# Altium project ESP32_XPID.PrjPCB
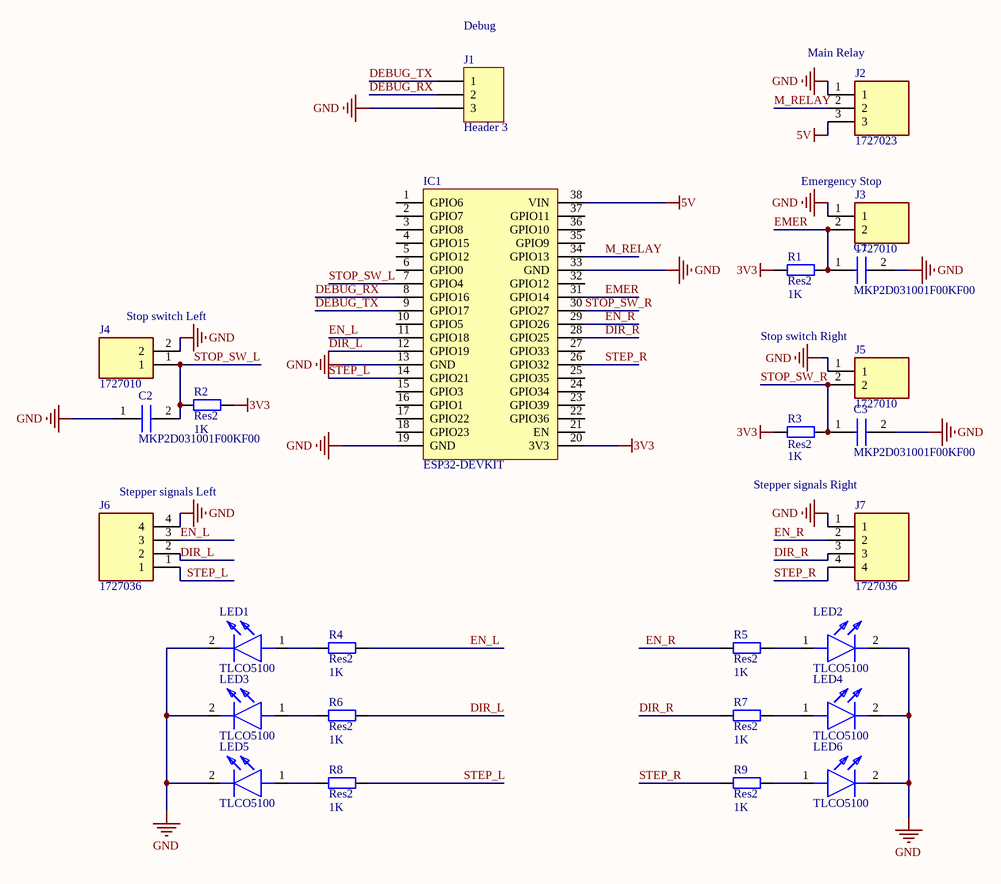
[diagram p0: ESP32_XPID.SchDoc]
1 sheet, 26 parts. Net scope: global (net labels, ports and power ports of the same name join across sheets).
Board file: ESP32_XPID.PcbDoc

## Sheet ESP32_XPID.SchDoc
size A1

### Parts
C1  MKP2D031001F00KF00  [MKP2D031001F00KF00]
C2  MKP2D031001F00KF00  [MKP2D031001F00KF00]
C3  MKP2D031001F00KF00  [MKP2D031001F00KF00]
IC1  ESP32-DEVKIT  [NODEMCU-32S]
J1  Header 3  [HDR1X3]
J2  1727023  [1727023]
J3  1727010  [1727010]
J4  1727010  [1727010]
J5  1727010  [1727010]
J6  1727036  [SHDR4W105P0X381_1X4_1523X730X865P]
J7  1727036  [SHDR4W105P0X381_1X4_1523X730X865P]
LED1  TLCO5100  [TLCO5100]
LED2  TLCO5100  [TLCO5100]
LED3  TLCO5100  [TLCO5100]
LED4  TLCO5100  [TLCO5100]
LED5  TLCO5100  [TLCO5100]
LED6  TLCO5100  [TLCO5100]
R1  Res2  value 1K  [AXIAL-0.4]
R2  Res2  value 1K  [AXIAL-0.4]
R3  Res2  value 1K  [AXIAL-0.4]
R4  Res2  value 1K  [AXIAL-0.4]
R5  Res2  value 1K  [AXIAL-0.4]
R6  Res2  value 1K  [AXIAL-0.4]
R7  Res2  value 1K  [AXIAL-0.4]
R8  Res2  value 1K  [AXIAL-0.4]
R9  Res2  value 1K  [AXIAL-0.4]

### Nets
3V3: IC1.20(3V3) R1.1 R2.2 R3.1
5V: IC1.38(VIN) J2.3
GND: C1.2 C2.1 C3.2 IC1.13(GND) IC1.19(GND) IC1.33(GND) J1.3 J2.1 J3.1 J4.2 J5.1 J6.4 J7.1 LED1.2(K) LED2.2(K) LED3.2(K) LED4.2(K) LED5.2(K) LED6.2(K)
DEBUG_RX: IC1.8(GPIO16) J1.2
DEBUG_TX: IC1.9(GPIO17) J1.1
DIR_L: IC1.12(GPIO19) J6.2 R6.1
DIR_R: IC1.28(GPIO25) J7.3 R7.1
EMER: C1.1 IC1.31(GPIO14) J3.2 R1.2
EN_L: IC1.11(GPIO18) J6.3 R4.1
EN_R: IC1.29(GPIO26) J7.2 R5.1
M_RELAY: IC1.34(GPIO13) J2.2
STEP_L: IC1.14(GPIO21) J6.1 R8.1
STEP_R: IC1.26(GPIO32) J7.4 R9.1
STOP_SW_L: C2.2 IC1.7(GPIO4) J4.1 R2.1
STOP_SW_R: C3.1 IC1.30(GPIO27) J5.2 R3.2
NetLED1_1: LED1.1(A) R4.2
NetLED2_1: LED2.1(A) R5.2
NetLED3_1: LED3.1(A) R6.2
NetLED4_1: LED4.1(A) R7.2
NetLED5_1: LED5.1(A) R8.2
NetLED6_1: LED6.1(A) R9.2

Not connected (* = marked no-connect by the designer): IC1 1(GPIO6) 2(GPIO7) 3(GPIO8) 4(GPIO15) 5(GPIO12) 6(GPIO0) 10(GPIO5) 15(GPIO3) 16(GPIO1) 17(GPIO22) 18(GPIO23) 21(EN) 22(GPIO36) 23(GPIO39) 24(GPIO34) 25(GPIO35) 27(GPIO33) 32(GPIO12) 35(GPIO9) 36(GPIO10) 37(GPIO11)

### Notes on the sheet
- (near J1) Debug
- (near J2) Main Relay
- (near J3) Emergency Stop
- (near J4) Stop switch Left
- (near J5) Stop switch Right
- (near J6) Stepper signals Left
- Stepper signals Right

### Library data of the parts
C1-C3 = MKP2D031001F00KF00: Capacitor; Manufacturer_Name: WIMA; Datasheet Link: http://www.mouser.com/datasheet/2/440/e_WIMA_MKP_2-1139746.pdf; Height: 10mm; Manufacturer_Part_Number: MKP2D031001F00KF00; Mouser Part Number: 505-MKP2D031001F00KF; Mouser Price/Stock: https://www.mouser.com/Search/Refine.aspx?Keyword=505-MKP2D031001F00KF
IC1 = NODE-MCU-32S: NODE-MCU ESP32 development kit
J1 = Header 3: Header, 3-Pin; LatestRevisionDate: 17-Jul-2002; LatestRevisionNote: Re-released for DXP Platform.; Publisher: Altium Limited
J2 = 1727023: Connector; Manufacturer_Name: Phoenix Contact; Datasheet Link: https://www.phoenixcontact.com/online/portal/us/pxc/product_detail_page/!ut/p/z1/3VdLc9owEP4r5MCtQpLf7kwPYBjzSAjEELAvHksWjBq_YhuS5tdX5tEmTAuHDDOtPTtjaaX9dr-1VpagB5fQS4ItXwclT5MgEn3X0_xZZ9brTSQN30_VDhp0Vat3qzzg_liCj9CDXhkQ6OKqFXGSB_kP6G4KllSKjIdiSJd0JMlVP1; Height: 8.65mm; Manufacturer_Part_Number: 1727023; Mouser Part Number: 651-1727023; Mouser Price/Stock: https://www.mouser.co.uk/ProductDetail/Phoenix-Contact/1727023?qs=tW%2FRIINyXrcH1wMFkkEATw%3D%3D
J3-J5 = 1727010: Connector; Manufacturer_Name: Phoenix Contact; Datasheet Link: https://www.phoenixcontact.com/online/portal/in?uri=pxc-oc-itemdetail:pid=1727010&library=inen&tab=1; Height: 8.65mm; Manufacturer_Part_Number: 1727010; Mouser Part Number: 651-1727010; Mouser Price/Stock: https://www.mouser.co.uk/ProductDetail/Phoenix-Contact/1727010?qs=JcjeNNoqGSMjtHhQoBJ7UA%3D%3D; Arrow Part Number: 1727010; Arrow Price/Stock: https://www.arrow.com/en/products/1727010/phoenix-contact
J6 J7 = 1727036: Connector; Manufacturer_Name: Phoenix Contact; Datasheet Link: https://www.phoenixcontact.com/online/portal/gb/?uri=pxc-oc-itemdetail:pid=1727036&library=gben&pcck=P-11-01-05&tab=1&selectedCategory=ALL; Height: 8.65mm; Manufacturer_Part_Number: 1727036; Mouser Part Number: 651-1727036; Mouser Price/Stock: https://www.mouser.co.uk/ProductDetail/Phoenix-Contact/1727036?qs=JcjeNNoqGSPP3LoUVQFt6g%3D%3D; Arrow Part Number: 1727036; Arrow Price/Stock: https://www.arrow.com/en/products/1727036/phoenix-contact
LED1-LED6 = TLCO5100: LED; Manufacturer_Name: Vishay; Datasheet Link: http://www.vishay.com/docs/81346/tlcx510.pdf; Height: 9.7mm; Manufacturer_Part_Number: TLCO5100; Mouser Part Number: 78-TLCO5100; Mouser Price/Stock: https://www.mouser.co.uk/ProductDetail/Vishay-Semiconductors/TLCO5100?qs=RzxYCzJDjPXeuyHzs7qbMg%3D%3D
R1-R9 = Res2: Resistor; Published: 8-Jun-2000; LatestRevisionDate: 17-Jul-2002; LatestRevisionNote: Re-released for DXP Platform.; PackageReference: AXIAL-0.4; Publisher: Altium Limited; PackageDescription: Axial Device, Thru-Hole; 2 Leads; 0.4 in Pin Spacing